# EAGLE schematic Datalogging_SMD_Prototye (EAGLE 6.0)
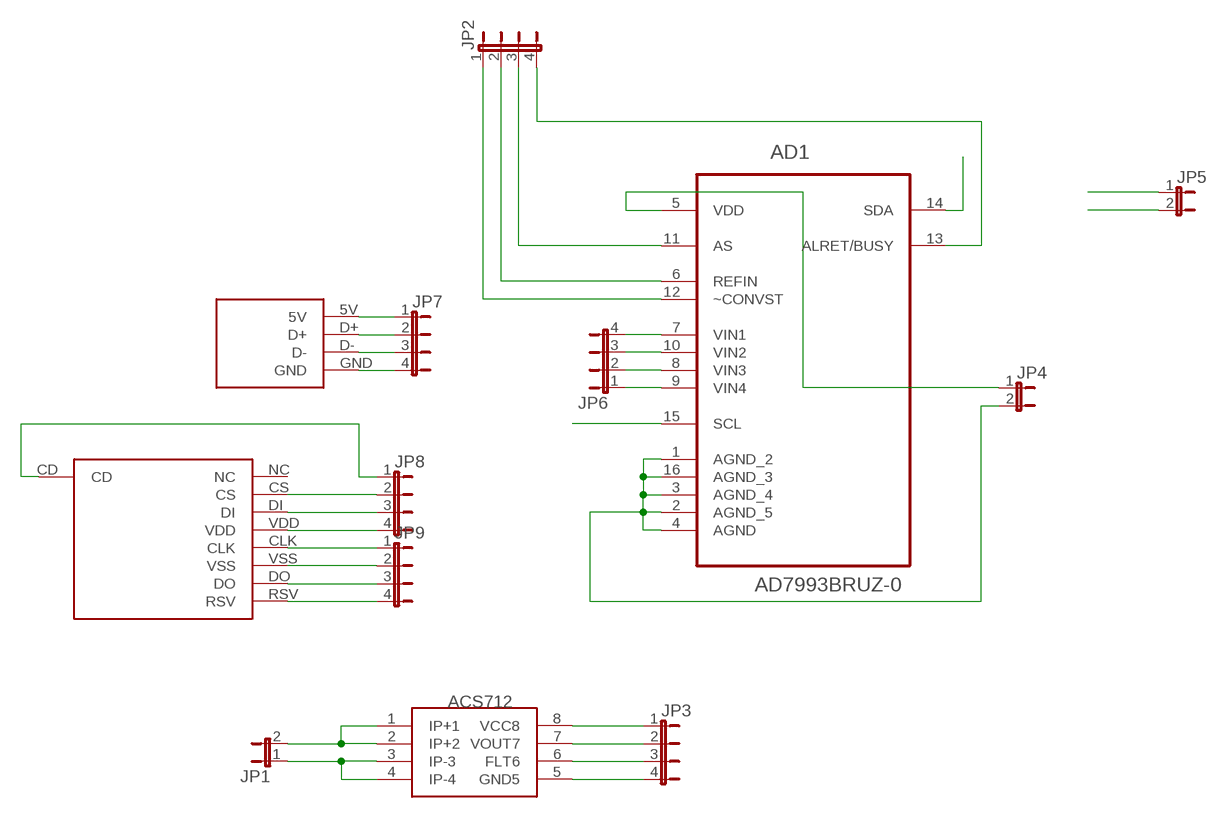
[diagram p0: schematic, sheet 1]

## Parts
AD1  AD7993BRUZ-0  [SOP65P640X120-16N]
JP1  JP1E  [JP1]
JP2  JP4E  [JP4]
JP3  JP4E  [JP4]
JP4  JP1E  [JP1]
JP5  JP1E  [JP1]
JP6  JP4E  [JP4]
JP7  JP4E  [JP4]
JP8  JP4E  [JP4]
JP9  JP4E  [JP4]
U$1  USBA_SOCKET  [USBA_SOCKET]
U$2  ACS712  [SO8]
U$3  MICROSD_SOCKET  [MICROSD_SOCKET]

## Nets
N$1: JP1.1 U$2.3(IP-3) U$2.4(IP-4)
N$2: JP1.2 U$2.1(IP+1) U$2.2(IP+2)
N$3: AD1.5(VDD) JP4.1
N$4: AD1.11(AS) JP2.3
N$5: AD1.1(AGND_2) AD1.2(AGND_5) AD1.3(AGND_4) AD1.4(AGND) AD1.16(AGND_3) JP4.2
N$6: JP3.2 U$2.7(VOUT7)
N$7: JP3.3 U$2.6(FLT6)
N$8: AD1.6(REFIN) JP2.2
N$9: AD1.12(~CONVST) JP2.1
N$10: AD1.13(ALRET/BUSY) JP2.4
N$12: AD1.7(VIN1) JP6.4
N$13: AD1.10(VIN2) JP6.3
N$14: AD1.8(VIN3) JP6.2
N$15: AD1.9(VIN4) JP6.1
N$19: JP7.4 U$1.GND
N$21: JP7.3 U$1.D-
N$24: JP7.2 U$1.D+
N$25: JP7.1 U$1.5V
N$26: JP8.1 U$3.CD
N$27: JP8.2 U$3.CS
N$28: JP8.3 U$3.DI
N$29: JP8.4 U$3.VDD
N$30: JP9.1 U$3.CLK
N$31: JP9.2 U$3.VSS
N$32: JP9.3 U$3.DO
N$33: JP9.4 U$3.RSV
N$36: JP3.4 U$2.5(GND5)
N$37: JP3.1 U$2.8(VCC8)
SCL: AD1.15(SCL) JP5.2
SDA: AD1.14(SDA) JP5.1
Unconnected: U$3.NC

## Library data of the parts
AD1 = ADC:AD7993BRUZ-0: ADC; MPN: AD7993BRUZ-0; OC_FARNELL: 1078309; OC_NEWARK: 59K6101; PACKAGE: TSSOP-16; SUPPLIER: Analog Devices
JP1 JP4 JP5 = jumper:JP1E: JUMPER
JP2 JP3 JP6-JP9 = jumper:JP4E: JUMPER
U$1 = ekohub2013:USBA_SOCKET
U$2 = eko-parts:ACS712
U$3 = ekohub2013:MICROSD_SOCKET